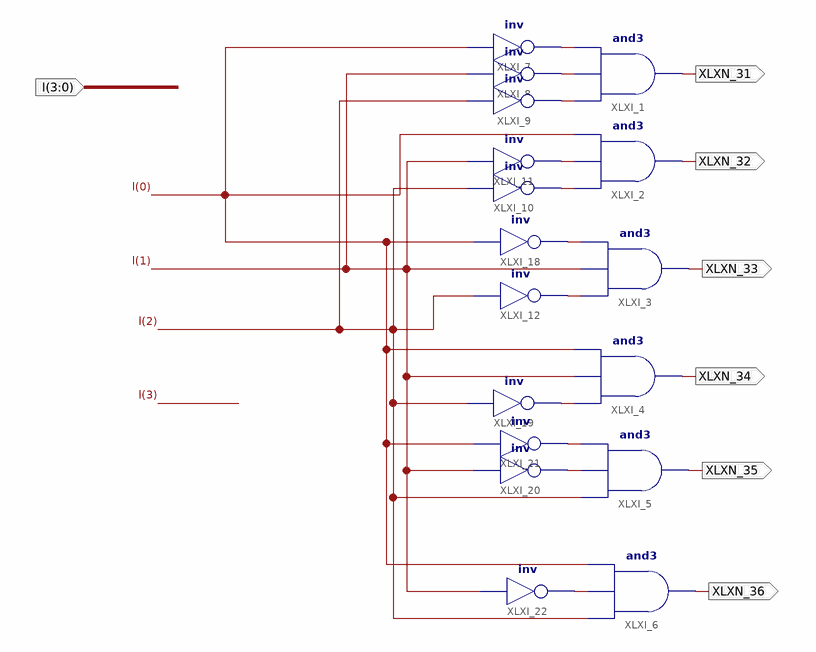
[diagram p0: schematic sheet 1]
// Xilinx ISE schematic xxx.sch (spartan6) as structural Verilog: 17 symbols, 7 ports
module xxx (
  input  [3:0] l,
  output XLXN_31,
  output XLXN_32,
  output XLXN_33,
  output XLXN_34,
  output XLXN_35,
  output XLXN_36
);

  wire XLXN_7, XLXN_8, XLXN_9, XLXN_10, XLXN_11, XLXN_12, XLXN_15, XLXN_16, XLXN_17, XLXN_18, XLXN_19;

  and XLXI_1 (XLXN_31, XLXN_9, XLXN_8, XLXN_7);
  and XLXI_2 (XLXN_32, XLXN_10, XLXN_11, l[0]);
  not XLXI_7 (XLXN_7, l[0]);
  not XLXI_8 (XLXN_8, l[1]);
  not XLXI_9 (XLXN_9, l[2]);
  not XLXI_10 (XLXN_10, l[2]);
  not XLXI_11 (XLXN_11, l[1]);
  and XLXI_3 (XLXN_33, XLXN_12, l[1], XLXN_15);
  and XLXI_4 (XLXN_34, XLXN_16, l[1], l[0]);
  and XLXI_5 (XLXN_35, l[2], XLXN_17, XLXN_18);
  and XLXI_6 (XLXN_36, l[2], XLXN_19, l[0]);
  not XLXI_12 (XLXN_12, l[2]);
  not XLXI_18 (XLXN_15, l[0]);
  not XLXI_19 (XLXN_16, l[2]);
  not XLXI_20 (XLXN_17, l[1]);
  not XLXI_21 (XLXN_18, l[0]);
  not XLXI_22 (XLXN_19, l[1]);
endmodule
